# Altium schematic sheet DISPLAY.SchDoc
size A; SheetNumber: 3; SheetTotal: 7
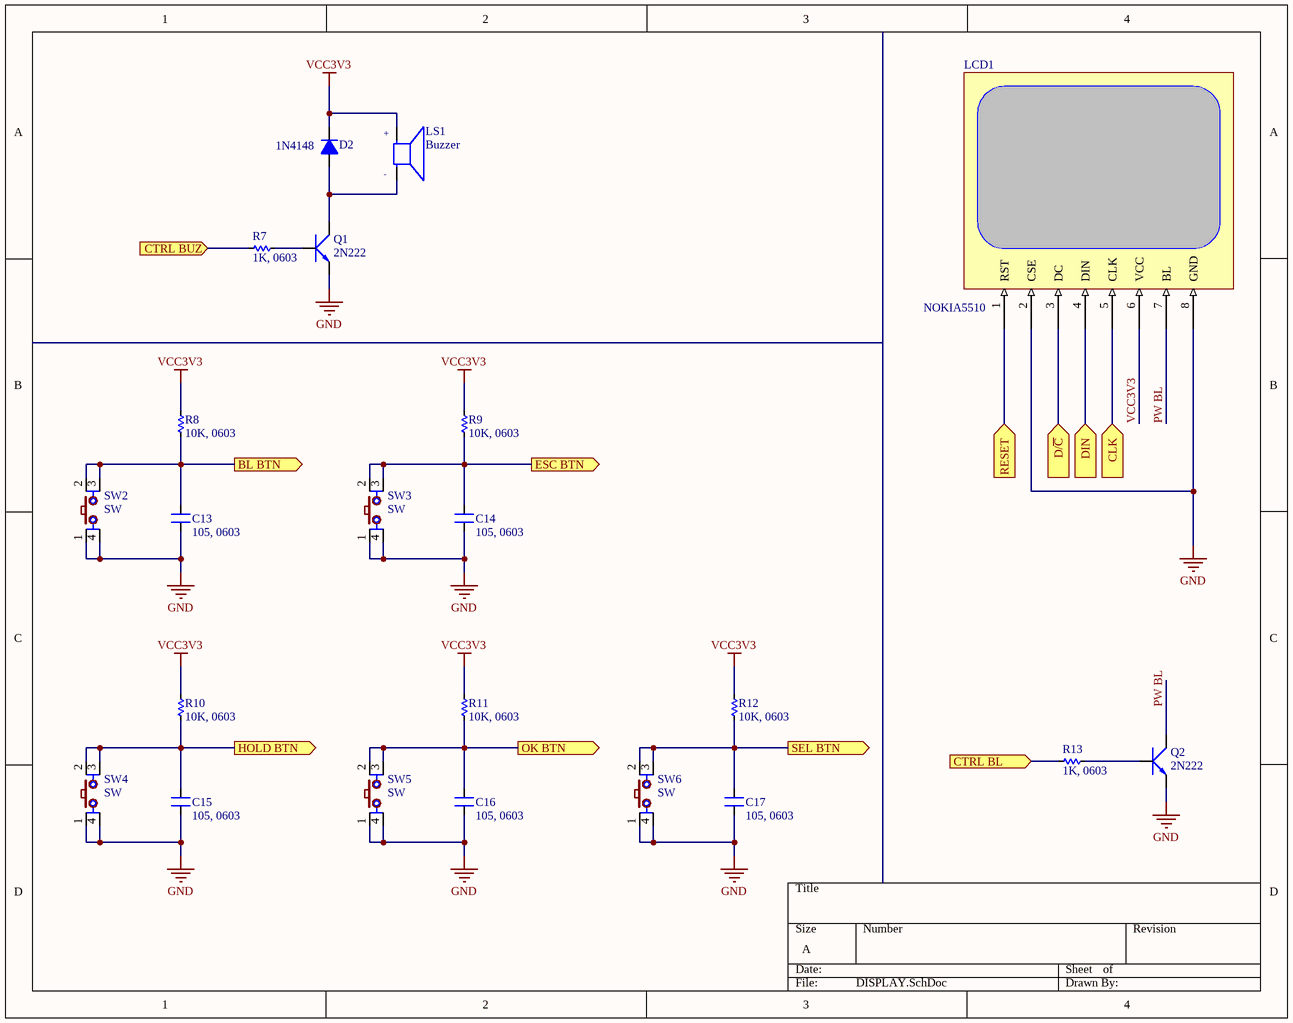
[diagram p0: DISPLAY.SchDoc]

## Parts
C13  105, 0603  [SM-0603]
C14  105, 0603  [SM-0603]
C15  105, 0603  [SM-0603]
C16  105, 0603  [SM-0603]
C17  105, 0603  [SM-0603]
D2  1N4148  [D0.5A]
LCD1  NOKIA5510
LS1  Buzzer  [XDCR_AI-1027-TWT-3V-R]
Q1  2N222  [TO92-123]
Q2  2N222  [TO92-123]
R7  1K, 0603  [RES-SMD-0603]
R8  10K, 0603  [RES-SMD-0603]
R9  10K, 0603  [RES-SMD-0603]
R10  10K, 0603  [RES-SMD-0603]
R11  10K, 0603  [RES-SMD-0603]
R12  10K, 0603  [RES-SMD-0603]
R13  1K, 0603  [RES-SMD-0603]
SW2  SW  [SW2-SMD]
SW3  SW  [SW2-SMD]
SW4  SW  [SW2-SMD]
SW5  SW  [SW2-SMD]
SW6  SW  [SW2-SMD]

## Ports
BL BTN (out), CLK (in), CTRL BL (in), CTRL BUZ (in), D/~{C} (in), DIN (in), ESC BTN (out), HOLD BTN (out), OK BTN (out), RESET (in), SEL BTN (out)

## Nets
GND: C13.1 C14.1 C15.1 C16.1 C17.1 LCD1.2(CSE) LCD1.8(GND) Q1.1(E) Q2.1(E) SW2.1 SW2.4 SW3.1 SW3.4 SW4.1 SW4.4 SW5.1 SW5.4 SW6.1 SW6.4
VCC3V3: D2.2(K) LCD1.6(VCC) LS1.P R8.2 R9.2 R10.2 R11.2 R12.2
BL BTN: C13.2 R8.1 SW2.2 SW2.3 ; port BL BTN
CLK: LCD1.5(CLK) ; port CLK
CTRL BL: R13.2 ; port CTRL BL
CTRL BUZ: R7.2 ; port CTRL BUZ
D/~{C}: LCD1.3(DC) ; port D/~{C}
DIN: LCD1.4(DIN) ; port DIN
ESC BTN: C14.2 R9.1 SW3.2 SW3.3 ; port ESC BTN
HOLD BTN: C15.2 R10.1 SW4.2 SW4.3 ; port HOLD BTN
OK BTN: C16.2 R11.1 SW5.2 SW5.3 ; port OK BTN
PW BL: LCD1.7(BL) Q2.3(C)
RESET: LCD1.1(RST) ; port RESET
SEL BTN: C17.2 R12.1 SW6.2 SW6.3 ; port SEL BTN
NetD2_1: D2.1(A) LS1.N Q1.3(C)
NetQ1_2: Q1.2(B) R7.1
NetQ2_2: Q2.2(B) R13.1

## Notes on the sheet
- (in symbol AI-1027-TWT-3V-R) +; -

## Library data of the parts
C13-C17 = CM: Cap SMD; Value: 103
D2 = D0.5A: Value: 1N4148
LS1 = AI-1027-TWT-3V-R: MF: {'manufacturer': u'PUI Audio,'}; Package: None; Price: None; Value: *; MP: AI-1027-TWT-3V-R; Availability: Unavailable
Q1 Q2 = 2N222: NPN 600mW, ECB; Value: C1815
R7-R13 = Res-SMD: Resistor; Manufacturer: Generic Components; Class: Passive; Published: 08/06/2000; Publisher: Altium Hobart Technology Centre
SW2-SW6 = SW4: Switch button 4 pin; Value: Button chip 4 pin